# EAGLE design SIO2Arduino (EAGLE 7.6.0)
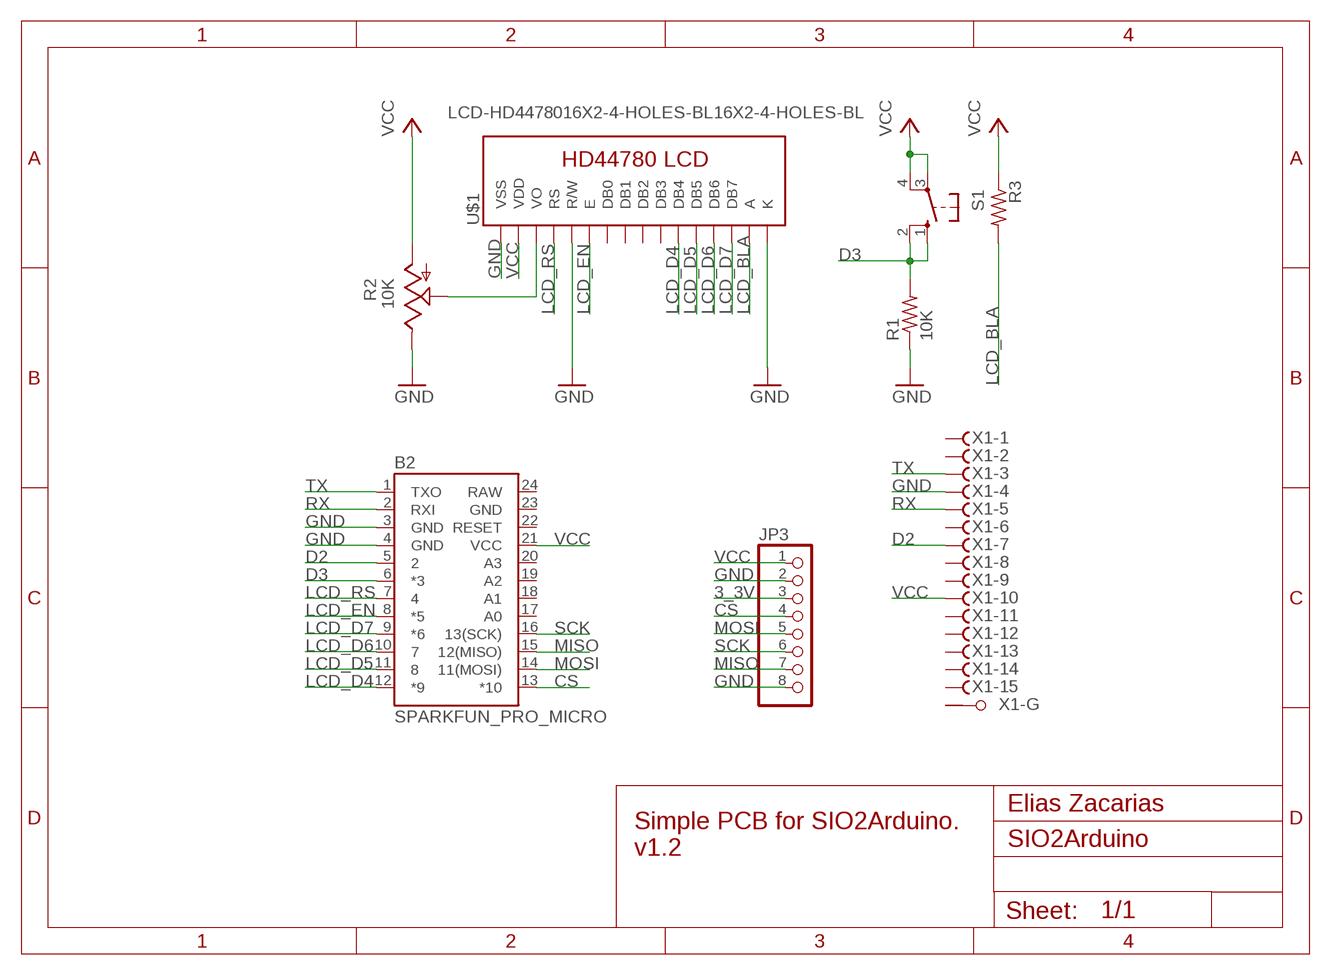
[diagram p0: schematic, sheet 1]

## Parts
B2  SPARKFUN_PRO_MICRO  [SPARKFUN_PRO_MICRO]
JP3  PINHD-1X8  [1X08]
R1  10K  R-US_0207/7  [0207/7]
R2  10K  TRIM_US-CA6V  [CA6V]
R3  R-US_0207/7  [0207/7]
S1  10-XX  [B3F-10XX]
U$1  LCD-HD4478016X2-4-HOLES-BL16X2-4-HOLES-BL  [LCD-16X2-4HOLES-BL]
X1  F15HPS  [F15HP]

## Nets
3_3V: JP3.3
CS: B2.13(*10) JP3.4
D2: B2.5 X1.7(-7:F)
D3: B2.6(*3) R1.2 S1.1(S) S1.2(S1)
GND: B2.3(GND) B2.4(GND) JP3.2 JP3.8 R1.1 R2.E U$1.1(VSS) U$1.5(R/W) U$1.16(K) X1.4(-4:F)
LCD_BLA: R3.2 U$1.15(A)
LCD_D4: B2.12(*9) U$1.11(DB4)
LCD_D5: B2.11 U$1.12(DB5)
LCD_D6: B2.10 U$1.13(DB6)
LCD_D7: B2.9(*6) U$1.14(DB7)
LCD_EN: B2.8(*5) U$1.6(E)
LCD_RS: B2.7 U$1.4(RS)
MISO: B2.15(12(MISO)) JP3.7
MOSI: B2.14(11(MOSI)) JP3.5
N$3: R2.S U$1.3(VO)
RX: B2.2(RXI) X1.5(-5:F)
SCK: B2.16(13(SCK)) JP3.6
TX: B2.1(TXO) X1.3(-3:F)
VCC: B2.21(VCC) JP3.1 R2.A R3.1 S1.3(P) S1.4(P1) U$1.2(VDD) X1.10(-10:F)
Unconnected: B2.17(A0) B2.18(A1) B2.19(A2) B2.20(A3) B2.22(RESET) U$1.7(DB0) U$1.8(DB1) U$1.9(DB2) U$1.10(DB3) X1.1(-1:F) X1.2(-2:F) X1.6(-6:F) X1.8(-8:F) X1.9(-9:F) X1.11(-11:F) X1.12(-12:F) X1.13(-13:F) X1.14(-14:F) X1.15(-15:F) X1.G1(-G:G1) X1.G2(-G:G2)

## Notes on the sheet
- Elias Zacarias
- Simple PCB for SIO2Arduino.
  v1.2

## Power pins joined to a net without a drawn wire
GND: B2.23(GND)
RAW: B2.24(RAW)

## Library data of the parts
B2 = SparkFun-Boards:SPARKFUN_PRO_MICRO: SparkFun Pro Micro Atmega32U4 compatible footprint. SparkFun Products: 3.3V/8MHz <https://www.sparkfun.com/products/12587> 5V/16MHz <https://www.sparkfun.com/products/12640>
JP3 = pinhead:PINHD-1X8: PIN HEADER
R1 R3 = resistor:R-US_: RESISTOR, American symbol
R2 = pot:TRIM_US-: POTENTIOMETER
S1 = switch-omron:10-XX: OMRON SWITCH; MPN: B3F-1000; OC_FARNELL: 176432; OC_NEWARK: 36M3542
U$1 = HD44780LCD_mod:LCD-HD44780
X1 = con-subd:F15HPS: SUB-D; OC_FARNELL: unknown; OC_NEWARK: unknown

## Board
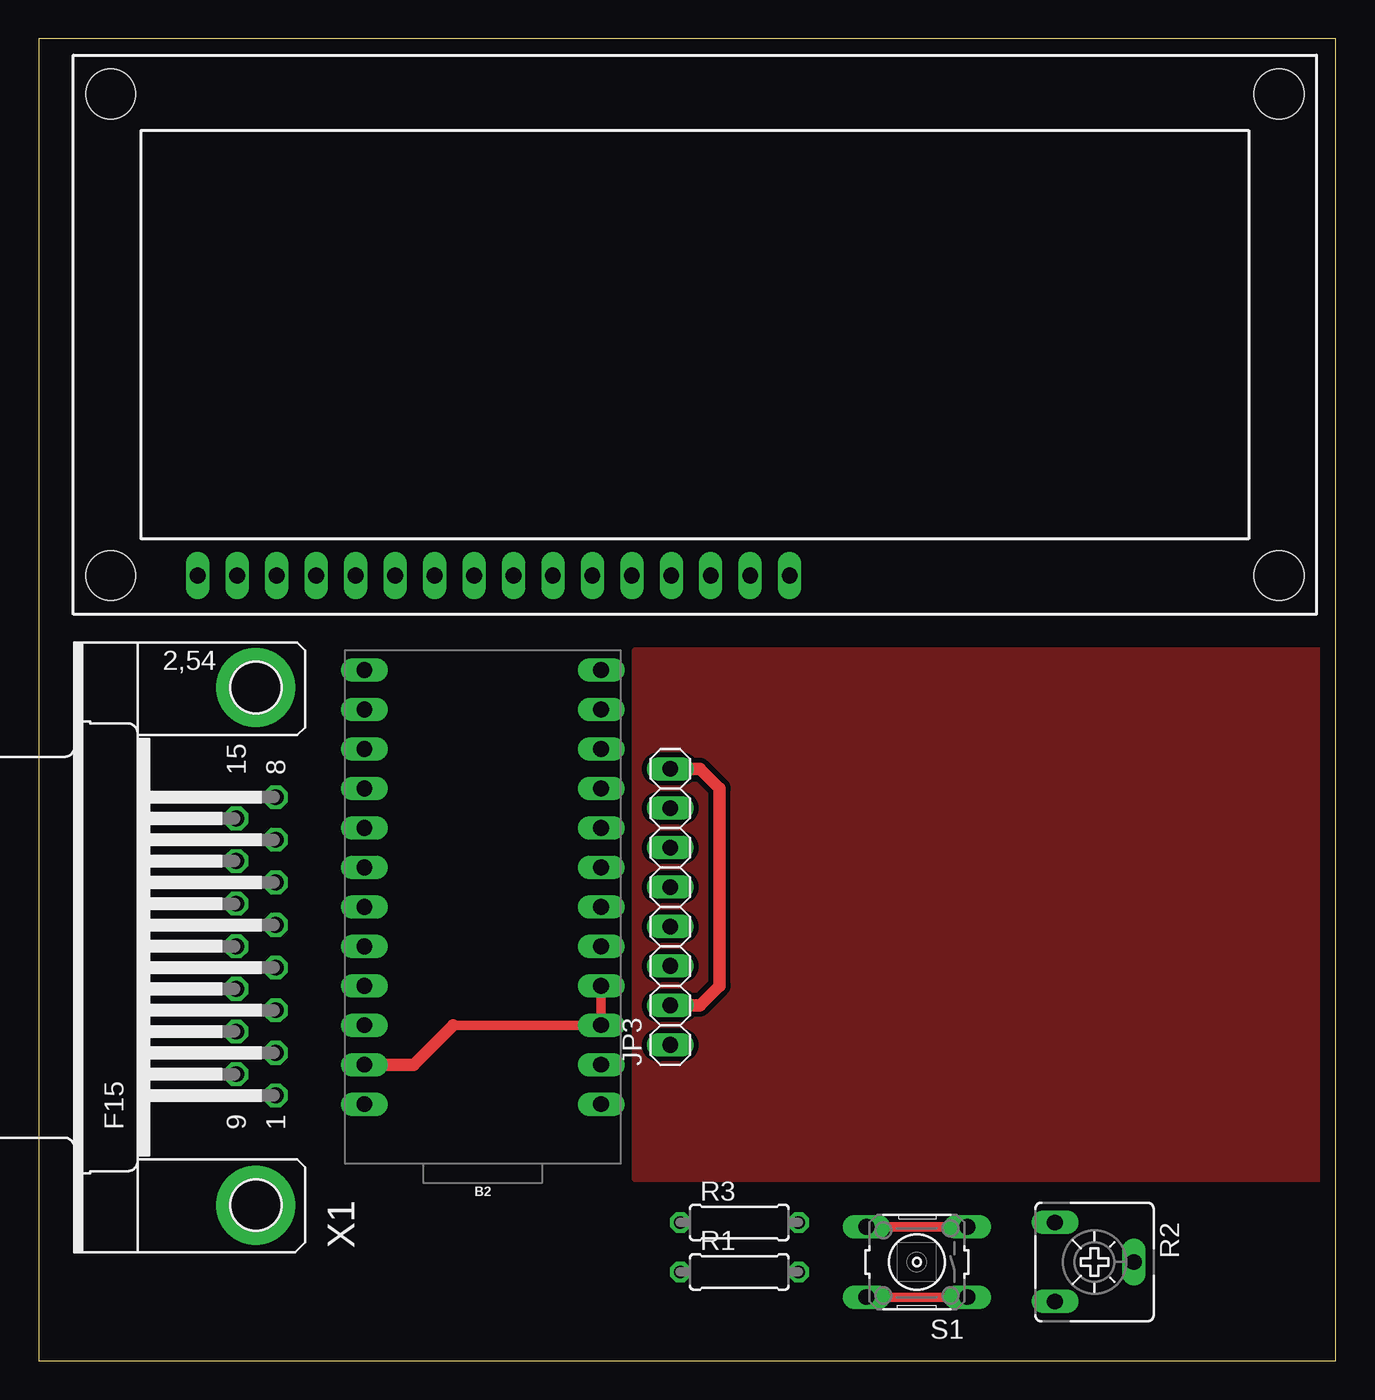
[diagram p1: board, top side]
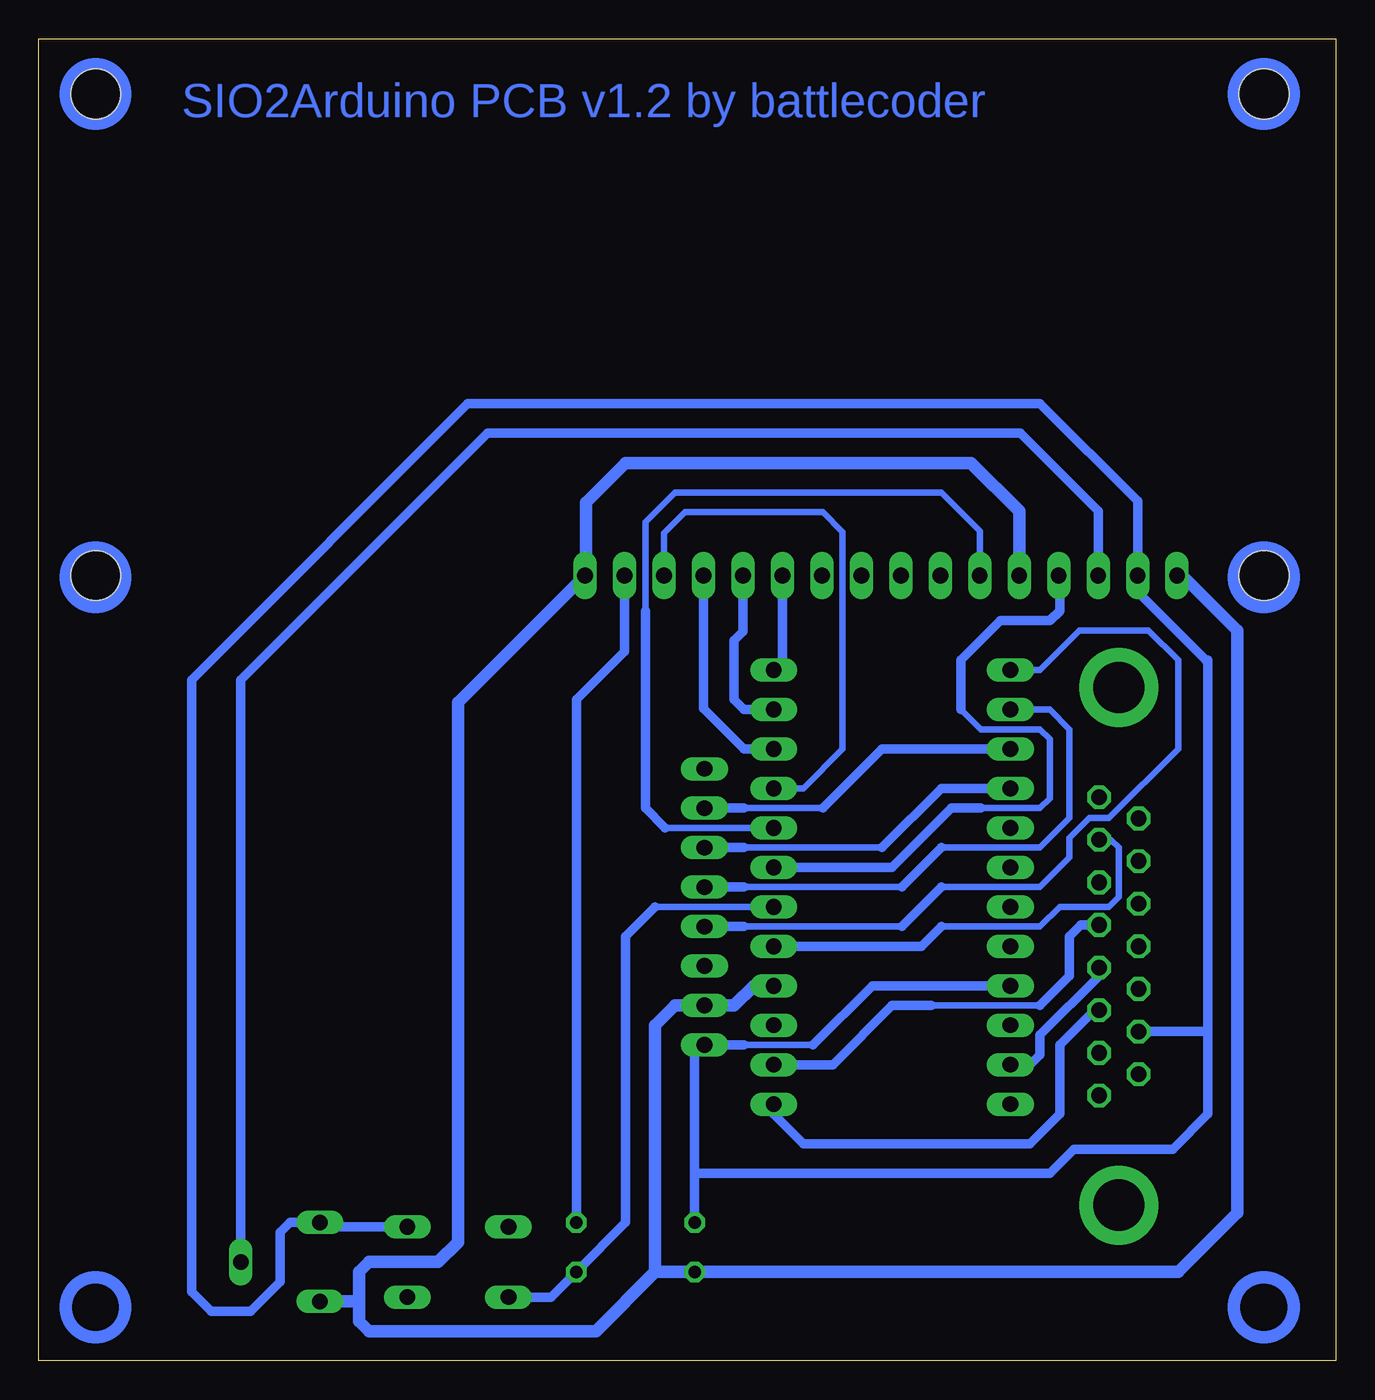
[diagram p2: board, bottom side, seen from below]

Size 83.49 x 85.08 mm. Coordinates in mm from the lower left corner, seen from the top.
Outline: 0,0 83.49,0 83.49,85.08 0,85.08 0,0
Copper layers (1*16): Top 0.035mm / dielectric 1.5mm / Bottom 0.035mm
Design rules "default *": minimum track width 10mil, minimum drill 24mil, track to track 12mil, track to pad 8mil, pad to pad 8mil, via to via 8mil, smd to smd 8mil, copper to edge 40mil, drill to drill 8mil, minimum pad ring 10mil, minimum via ring 8mil, stop-mask expansion 4mil, vias tented up to drill 0mil, thermal gap 10mil

### Footprints (pad centres in the part's own frame; a part is rotated, then mirrored left to right if it is on the bottom)
SPARKFUN_PRO_MICRO = drill 1.016 pad 1.422 long: 1 -7.62,12.7; 2 -7.62,10.16; 3 -7.62,7.62; 4 -7.62,5.08; 5 -7.62,2.54; 6 -7.62,0; 7 -7.62,-2.54; 8 -7.62,-5.08; 9 -7.62,-7.62; 10 -7.62,-10.16; 11 -7.62,-12.7; 12 -7.62,-15.24; 13 7.62,-15.24; 14 7.62,-12.7; 15 7.62,-10.16; 16 7.62,-7.62; 17 7.62,-5.08; 18 7.62,-2.54; 19 7.62,0; 20 7.62,2.54; 21 7.62,5.08; 22 7.62,7.62; 23 7.62,10.16; 24 7.62,12.7
1X08 = drill 1.016 long: 1 -8.89,0; 2 -6.35,0; 3 -3.81,0; 4 -1.27,0; 5 1.27,0; 6 3.81,0; 7 6.35,0; 8 8.89,0
0207/7 = drill 0.813 octagon: 1 -3.81,0; 2 3.81,0
CA6V = drill 1.016 long: A -2.54,-2.54; E 2.54,-2.54; S 0,2.54
B3F-10XX = drill 1.016 long: 1 -3.251,2.261; 2 3.251,2.261; 3 -3.251,-2.261; 4 3.251,-2.261
LCD-16X2-4HOLES-BL = drill 1.016 long: 1 -32,-15.5; 2 -29.46,-15.5; 3 -26.92,-15.5; 4 -24.38,-15.5; 5 -21.84,-15.5; 6 -19.3,-15.5; 7 -16.76,-15.5; 8 -14.22,-15.5; 9 -11.68,-15.5; 10 -9.14,-15.5; 11 -6.6,-15.5; 12 -4.06,-15.5; 13 -1.52,-15.5; 14 1.02,-15.5; 15 3.56,-15.5; 16 6.1,-15.5 | hole 3.2: -37.6,15.5; -37.6,-15.5; 37.6,-15.5; 37.6,15.5
F15HP = drill 1.016 octagon: 1 -9.601,-1.27; 2 -6.858,-1.27; 3 -4.115,-1.27; 4 -1.372,-1.27; 5 1.372,-1.27; 6 4.115,-1.27; 7 6.858,-1.27; 8 9.601,-1.27; 9 -8.23,1.27; 10 -5.486,1.27; 11 -2.743,1.27; 12 0,1.27; 13 2.743,1.27; 14 5.486,1.27; 15 8.23,1.27 | drill 3.302 pad 5.08: G1 -16.662,0; G2 16.662,0

### Placement (x,y rotation side)
B2  28.57,29.21 180 top
JP3  40.64,29.21 90 top
R1  45.09,5.71 0 top
R2  67.94,6.35 270 top
R3  45.09,8.89 0 top
S1  56.52,6.35 180 top
U$1  42.23,66.04 0 top
X1  13.97,26.67 90 top

### Tracks (layer width: path | path; a pad name or v marks a point on that pad's centre or on a via)
CS
  Bottom 0.406: B2.13 19.05,44.45 16.51,46.99 12.06,46.99 10.16,45.09 10.16,39.37 14.61,34.93 15.88,34.93 17.14,33.66 17.14,32.39 19.05,30.48 25.4,30.48 | 38.1,27.94 27.94,27.94
  Bottom 0.61: JP3.4 38.1,27.94 | 25.4,30.48 27.94,27.94
D2
  Bottom 0.406: X1.7 14.48,33.53 13.97,33.02 13.97,29.84 14.61,29.21 17.78,29.21 19.05,27.94 25.4,27.94
  Bottom 0.61: B2.5 26.67,26.67 25.4,27.94
D3
  Top 0.61: S1.1 S1.2
  Bottom 0.406: B2.6 43.81,29.21
  Bottom 0.61: 43.81,29.21 45.72,27.3 45.72,8.89 R1.2 50.52,4.09 S1.2
GND
  Top 0.61: 26.67,21.59 B2.3 B2.4
  Top 0.813: JP3.2 42.55,22.86 43.81,24.13 43.81,36.83 42.55,38.1 JP3.8 | B2.23 24.13,19.05 26.67,21.59
  Bottom 0.61: X1.4 15.24,24.76 19.05,20.95 19.05,19.68 19.68,19.05 B2.23
  Bottom 0.813: U$1.5 20.39,54.68 23.5,57.79 45.72,57.79 48.26,55.25 48.26,50.61 U$1.16 56.52,42.35 56.52,7.62 57.78,6.35 62.23,6.35 62.87,5.71 62.87,3.81 | 62.87,3.81 62.87,2.54 62.23,1.91 47.62,1.91 43.81,5.71 | 43.81,5.71 43.81,21.59 42.55,22.86 JP3.2 38.73,22.86 37.47,24.13 B2.4 | 43.81,5.71 R1.1 10.16,5.71 6.35,9.53 6.35,46.99 9.9,50.54 U$1.1 | R2.E 62.87,3.81
LCD_BLA
  Bottom 0.61: R3.2 48.9,42.55 45.79,45.65 U$1.15
LCD_D4
  Bottom 0.61: U$1.11 35.63,45.02 B2.12
LCD_D5
  Bottom 0.61: U$1.12 38.17,46.92 38.73,46.36 38.73,42.55 38.1,41.91 B2.11
LCD_D6
  Bottom 0.61: B2.10 38.1,39.37 40.71,41.98 U$1.13
LCD_D7
  Bottom 0.406: B2.9 34.29,36.83 31.75,39.37 31.75,53.34 33.02,54.61 41.91,54.61 43.25,53.27 U$1.14
LCD_EN
  Bottom 0.406: 43.18,34.29 B2.8 | U$1.6 22.93,53.41 25.4,55.88 42.55,55.88 44.45,53.98 44.45,48.26
  Bottom 0.61: 44.45,48.26 44.45,35.56 43.18,34.29
LCD_RS
  Bottom 0.406: 24.13,41.91 22.86,40.64 19.05,40.64 18.41,40.01 18.41,36.2 19.05,35.56 22.86,35.56
  Bottom 0.61: B2.7 28.57,31.75 24.77,35.56 22.86,35.56 | U$1.4 17.78,50.54 17.78,48.26 18.41,47.62 21.59,47.62 24.13,45.09 24.13,41.91
MISO
  Bottom 0.406: 33.02,35.56 38.1,35.56
  Bottom 0.61: JP3.7 38.1,35.56 | B2.15 29.21,39.37 33.02,35.56
MOSI
  Bottom 0.406: B2.14 18.41,41.91 17.14,40.64 17.14,34.93 19.05,33.02 25.4,33.02 | 38.1,30.48 27.94,30.48
  Bottom 0.61: JP3.5 38.1,30.48 | 25.4,33.02 27.94,30.48
N$3
  Bottom 0.61: R2.S 70.48,43.82 54.61,59.69 20.32,59.69 15.31,54.68 U$1.3
RX
  Bottom 0.406: 26.04,22.86 19.05,22.86
  Bottom 0.61: B2.2 32.38,19.05 28.57,22.86 26.04,22.86 | X1.5 16.41,28.04 17.14,27.3 17.14,24.76 19.05,22.86
SCK
  Bottom 0.406: 38.1,33.02 29.21,33.02
  Bottom 0.61: JP3.6 38.1,33.02 | B2.16 25.4,36.83 29.21,33.02
SD_OUTLINE
  pour Top: 38.38,45.72 38.38,11.71 82.38,11.71 82.38,45.72
TX
  Bottom 0.61: X1.3 15.54,22.55 17.78,20.32 17.78,15.88 19.68,13.97 34.29,13.97 36.2,15.88 B2.1
VCC
  Top 0.61: S1.4 S1.3
  Bottom 0.406: 33.66,20.32 38.1,20.32
  Bottom 0.61: 8.26,20.95 8.26,45.09 8.39,45.09 12.77,49.46 U$1.2 12.77,55.31 19.05,61.59 55.88,61.59 73.66,43.82 73.66,4.45 72.39,3.17 69.85,3.17 67.94,5.08 67.94,8.26 67.31,8.89 R2.A 65.13,8.61 S1.3 | 8.26,20.95 8.26,15.88 10.52,13.61 16.87,13.61 18.41,12.06 41.27,12.06 | X1.10 8.48,21.18 8.26,20.95 | 33.66,20.32 29.84,24.13 B2.21 | 38.1,20.32 JP3.1 41.27,19.68 41.27,12.06 | R3.1 41.27,12.06
(copper drawn outside any net)
  shapes: Bottom circle x6

### Text on the board
Bottom: SIO2Arduino PCB v1.2 by battlecoder